# EAGLE design UnoSensor (EAGLE 9.3.0)
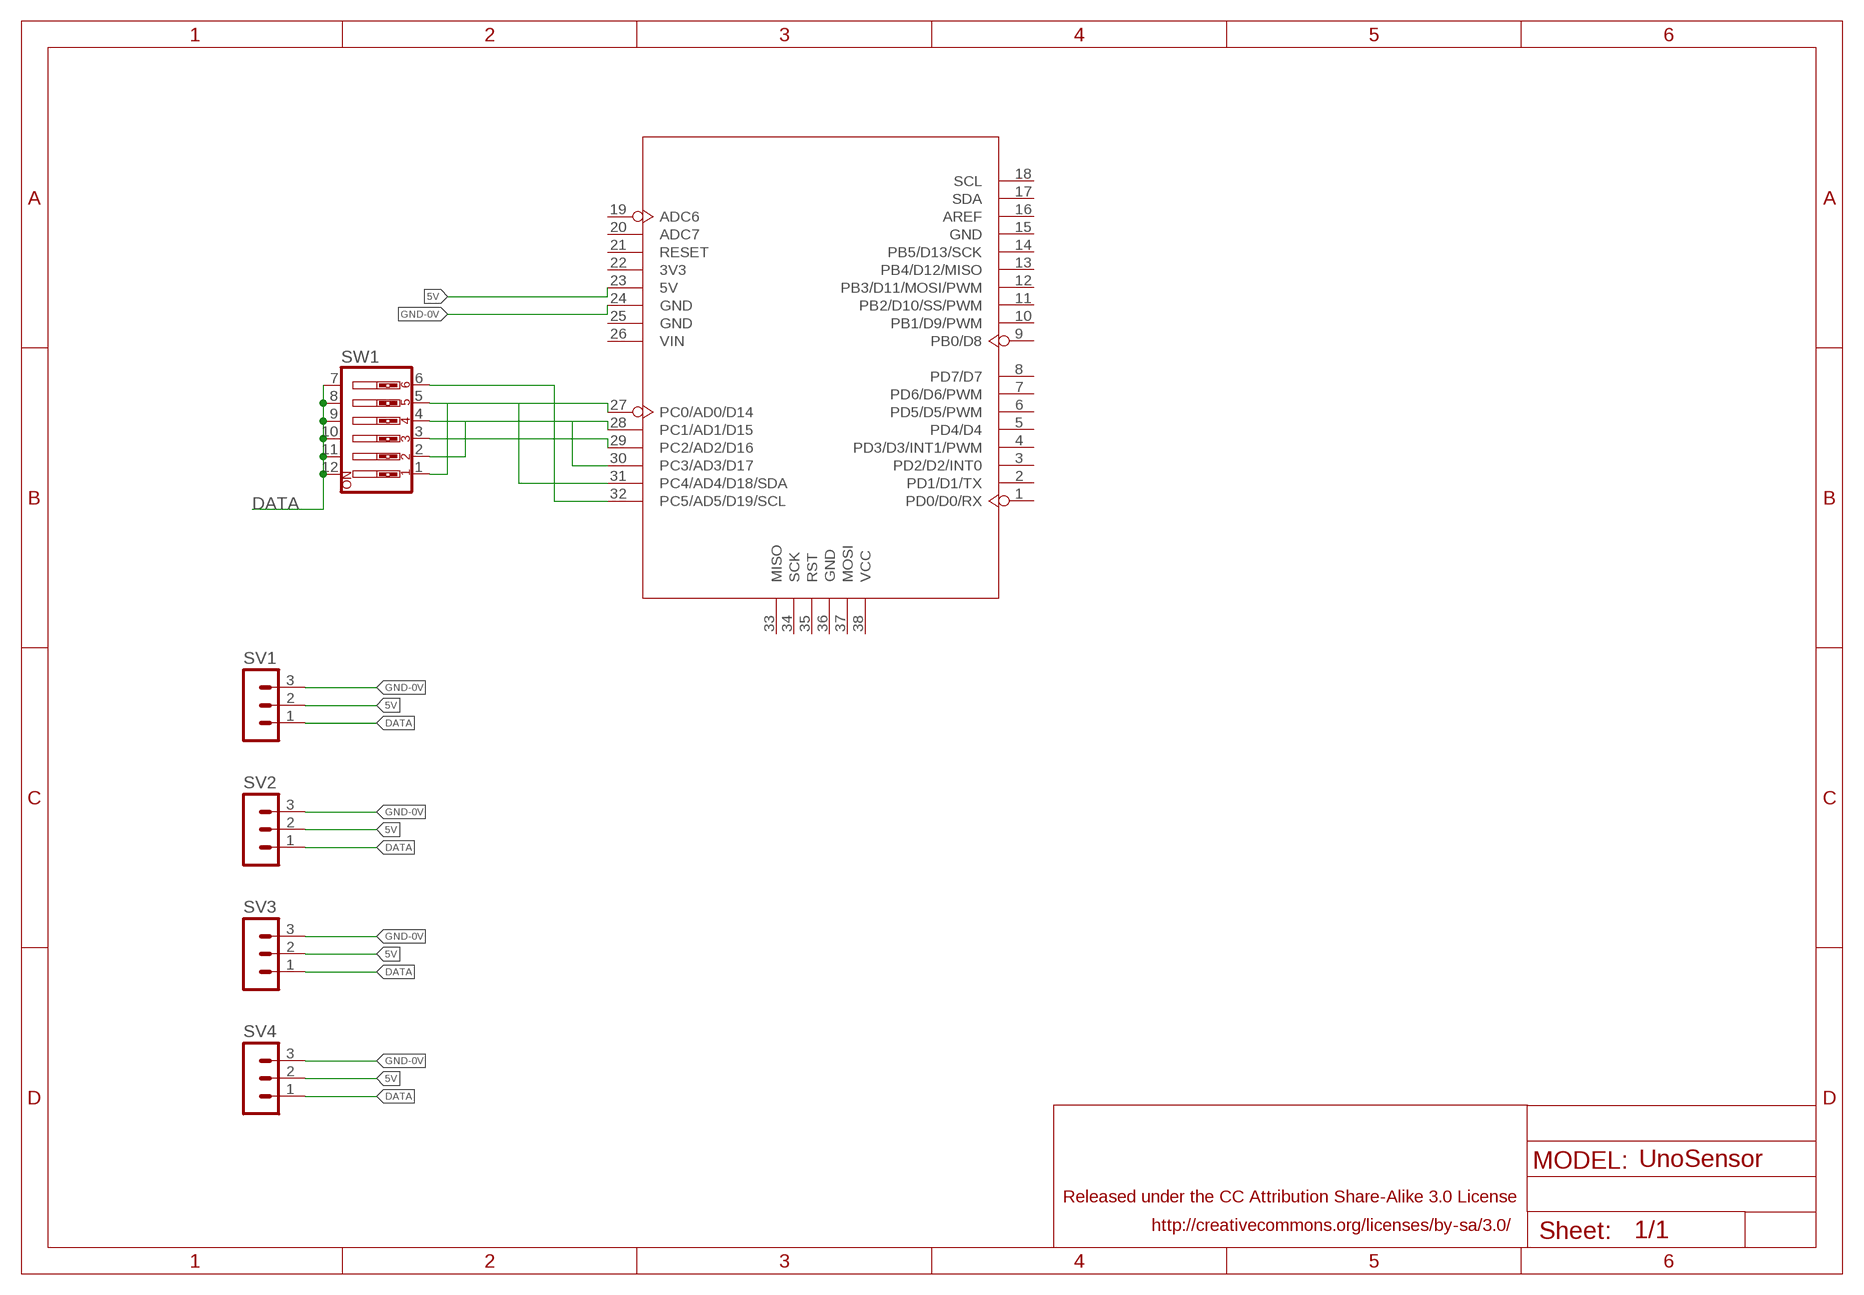
[diagram p0: schematic, sheet 1]

## Parts
SV1  2  MA03-1  [MA03-1]
SV2  MA03-1  [MA03-1]
SV3  MA03-1  [MA03-1]
SV4  MA03-1  [MA03-1]
SW1  SW_DIP-6  [EDG-06]
U5  MOUDLE_ARDUINO-38P328P_NO_VIA  [MOUDLE_ARDUINO-328P--]

## Nets
5V: SV1.2 SV2.2 SV3.2 SV4.2 U5.23(5V)
DATA: SV1.1 SV2.1 SV3.1 SV4.1 SW1.7 SW1.8 SW1.9 SW1.10 SW1.11 SW1.12
GND-0V: SV1.3 SV2.3 SV3.3 SV4.3 U5.24(GND)
N$1: SW1.1 U5.27(PC0/AD0/D14)
N$3: SW1.2 U5.28(PC1/AD1/D15)
N$4: SW1.3 U5.29(PC2/AD2/D16)
N$5: SW1.4 U5.30(PC3/AD3/D17)
N$6: SW1.5 U5.31(PC4/AD4/D18/SDA)
N$7: SW1.6 U5.32(PC5/AD5/D19/SCL)
Unconnected: U5.1(PD0/D0/RX) U5.2(PD1/D1/TX) U5.3(PD2/D2/INT0) U5.4(PD3/D3/INT1/PWM) U5.5(PD4/D4) U5.6(PD5/D5/PWM) U5.7(PD6/D6/PWM) U5.8(PD7/D7) U5.9(PB0/D8) U5.10(PB1/D9/PWM) U5.11(PB2/D10/SS/PWM) U5.12(PB3/D11/MOSI/PWM) U5.13(PB4/D12/MISO) U5.14(PB5/D13/SCK) U5.15(GND) U5.16(AREF) U5.17(SDA) U5.18(SCL) U5.19(ADC6) U5.20(ADC7) U5.21(RESET) U5.22(3V3) U5.25(GND) U5.26(VIN) U5.33(MISO) U5.34(SCK) U5.35(RST) U5.36(GND) U5.37(MOSI) U5.38(VCC)

## Library data of the parts
SV1-SV4 = CON_LSTB:MA03-1: PIN HEADER
SW1 = SPECIAL:SW_DIP-6: DIP SWITCH
U5 = board_arduino:MOUDLE_ARDUINO-38P

## Net classes
0 default: clearance 0.205 mm
2 gnd: width 0.305 mm, drill 0.305 mm, clearance 0.254 mm

## Board
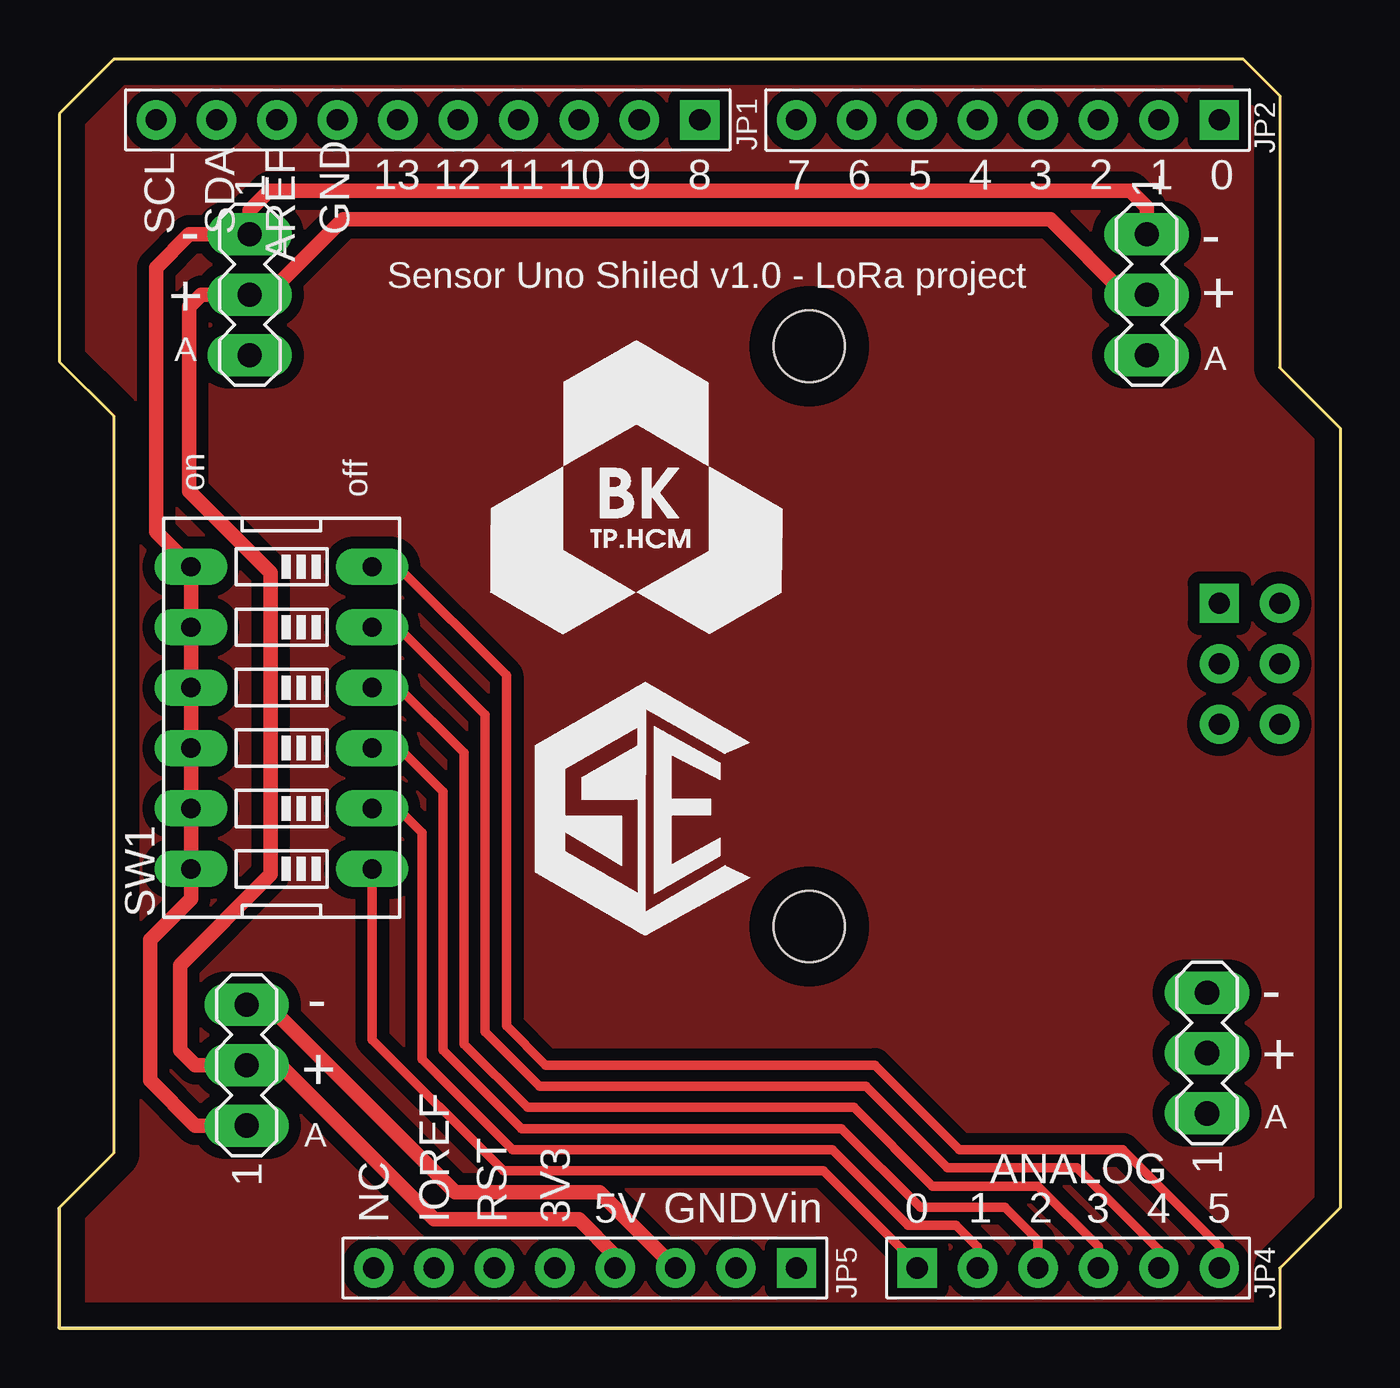
[diagram p1: board, top side]
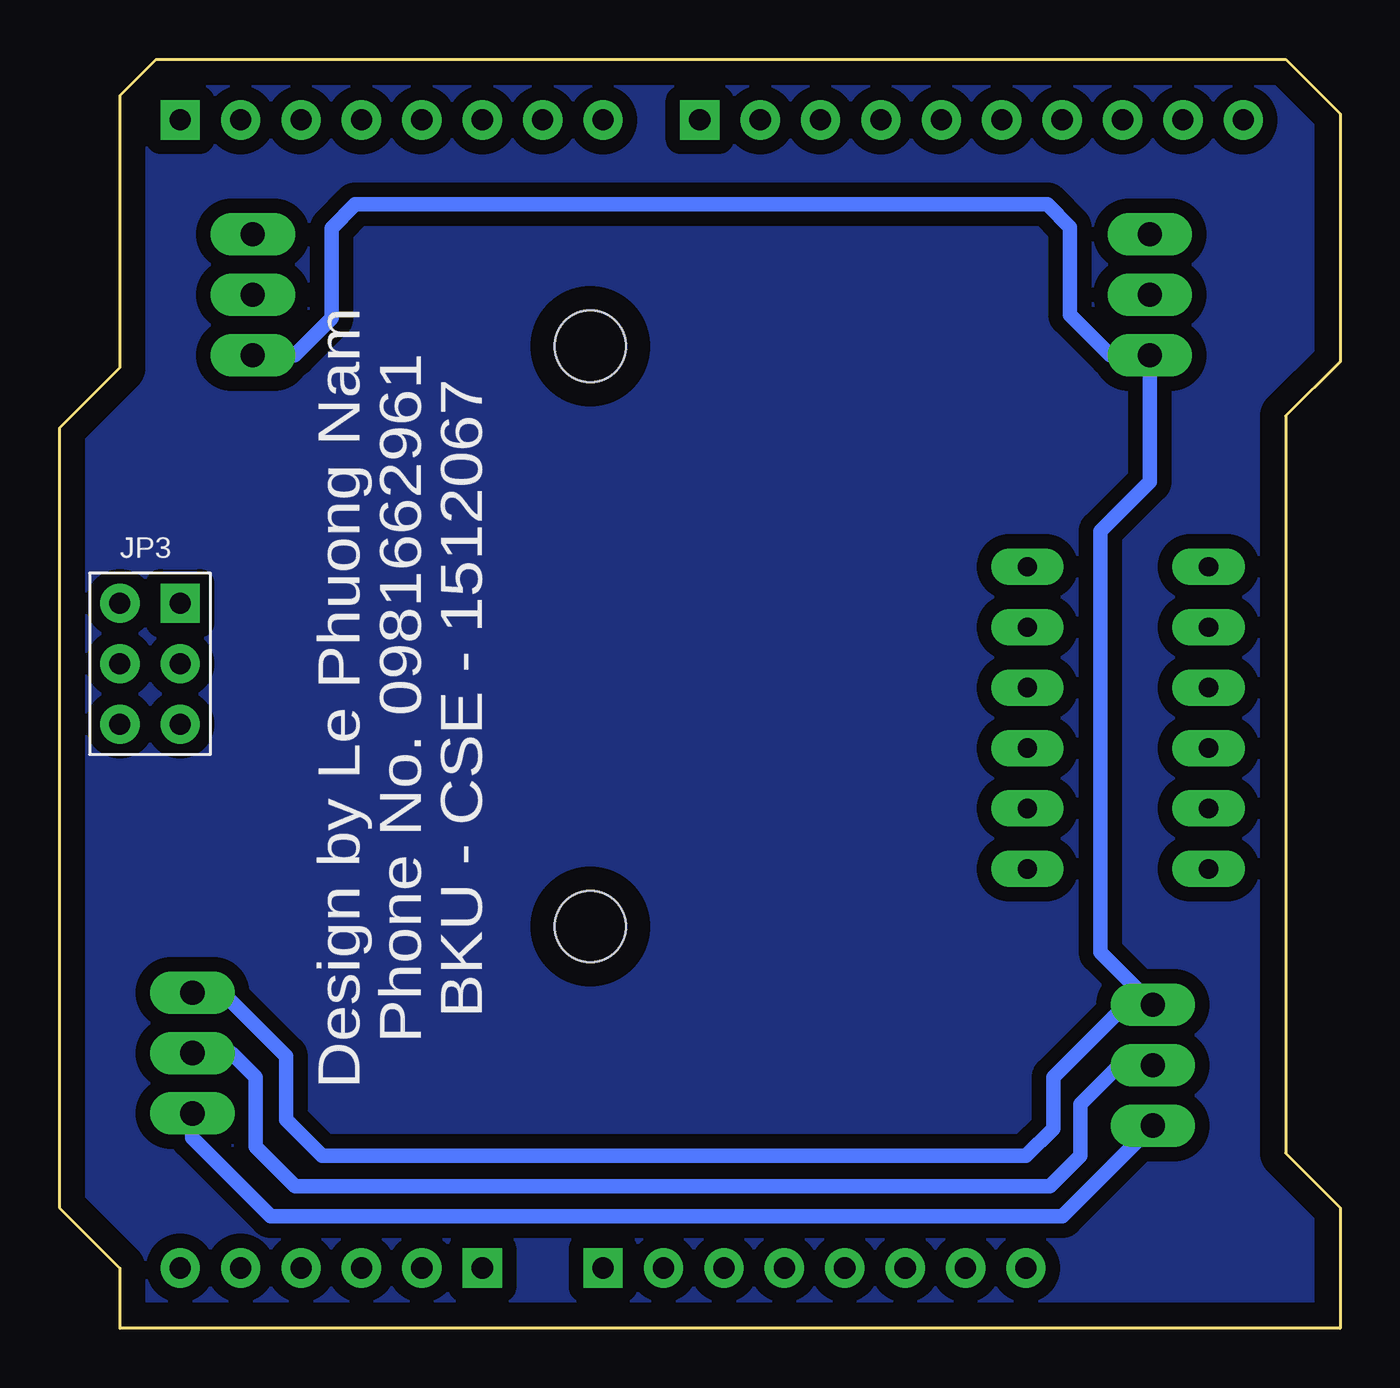
[diagram p2: board, bottom side, seen from below]

Size 53.85 x 53.34 mm. Coordinates in mm from the lower left corner, seen from the top.
Copper layers (1*16): Top 0.035mm / dielectric 1.5mm / Bottom 0.035mm
Design rules "default *": minimum track width 10mil, minimum drill 10mil, track to track 10mil, track to pad 10mil, pad to pad 10mil, via to via 10mil, smd to smd 10mil, copper to edge 40mil, drill to drill 10mil, minimum pad ring 10mil, minimum via ring 8mil, stop-mask expansion 4mil, vias tented up to drill 30mil, thermal gap 10mil
Holes 3 mm at 31.53,16.9 31.53,41.29

### Footprints (pad centres in the part's own frame; a part is rotated, then mirrored left to right if it is on the bottom)
MA03-1 = drill 1.016 pad 1.778 long: 1 -2.54,0; 2 0,0; 3 2.54,0
EDG-06 = drill 0.813 pad 1.524 long: 1 -6.35,-3.81; 2 -3.81,-3.81; 3 -1.27,-3.81; 4 1.27,-3.81; 5 3.81,-3.81; 6 6.35,-3.81; 7 6.35,3.81; 8 3.81,3.81; 9 1.27,3.81; 10 -1.27,3.81; 11 -3.81,3.81; 12 -6.35,3.81
MOUDLE_ARDUINO-328P-- = drill 0.889 pad 1.651 square: 1 27.94,24.13; 9 6.096,24.13; 26 10.16,-24.13; 27 15.24,-24.13; 33 27.94,3.81 | drill 0.889 pad 1.651: 2 25.4,24.13; 3 22.86,24.13; 4 20.32,24.13; 5 17.78,24.13; 6 15.24,24.13; 7 12.7,24.13; 8 10.16,24.13; 10 3.556,24.13; 11 1.016,24.13; 12 -1.524,24.13; 13 -4.064,24.13; 14 -6.604,24.13; 15 -9.144,24.13; 16 -11.684,24.13; 17 -14.224,24.13; 18 -16.764,24.13; 19 -7.62,-24.13; 20 -5.08,-24.13; 21 -2.54,-24.13; 22 0,-24.13; 23 2.54,-24.13; 24 5.08,-24.13; 25 7.62,-24.13; 28 17.78,-24.13; 29 20.32,-24.13; 30 22.86,-24.13; 31 25.4,-24.13; 32 27.94,-24.13; 34 27.94,1.27; 35 27.94,-1.27; 36 30.48,-1.27; 37 30.48,1.27; 38 30.48,3.81

### Placement (x,y rotation side)
SV1  7.87,11.07 90 top
SV2  8,43.45 270 top
SV3  45.72,43.45 270 top
SV4  48.26,11.58 90 top
SW1  9.34,25.67 90 top
U5  20.83,26.67 0 top

### Tracks (layer width: path | path; a pad name or v marks a point on that pad's centre or on a via)
5V
  Top 0.61: SV3.2 44.83,43.45 41.67,46.61 11.92,46.61 8.76,43.45 SV2.2 5.97,43.45 5.46,42.94 5.46,35.2 8.89,31.77 8.89,19.08 5.08,15.27 5.08,11.7 5.71,11.07 SV1.2 9.27,11.07 15.75,4.59 21.84,4.59 23.37,3.07 U5.23
  Bottom 0.61: SV1.2 9.27,11.07 10.92,9.42 10.92,7.26 12.19,5.99 43.94,5.99 45.59,7.64 45.59,10.56 46.61,11.58 SV4.2
BOTTOM_SOLID
  pour Bottom (isolate 0.61): 0,0.02 51.31,0.02 51.31,2.56 53.85,5.1 53.85,37.86 51.31,40.4 51.31,51.83 49.78,53.36 2.28,53.36 0,51.07 0,40.66 2.28,38.37 2.28,7.38 0,5.1
DATA
  Top 0.61: SV1.1 5.71,8.53 3.81,10.43 3.81,16.34 5.53,18.06 SW1.12 SW1.11 SW1.10 SW1.9 SW1.8 SW1.7 4.06,33.48 4.06,44.6 5.46,45.99 SV2.1 8,47.01 8.81,47.82 45.03,47.82 45.72,47.14 SV3.1
  Bottom 0.61: SV1.1 11.68,4.72 44.96,4.72 48.26,8.02 SV4.1
GND-0V
  Top 0.61: SV1.3 8.76,13.61 16.64,5.73 22.72,5.73 U5.24
  Bottom 0.61: SV3.3 43.96,40.91 42.41,42.46 42.41,46.25 41.41,47.25 12.31,47.25 11.36,46.29 11.36,42.62 9.65,40.91 SV2.3 8,35.59 10.08,33.51 10.08,15.82 SV1.3 9.02,13.61 12.06,10.56 12.06,8.4 13.21,7.26 42.8,7.26 44.32,8.78 44.32,11.45 47.12,14.24 47.5,14.24 47.62,14.12 SV4.3
N$1
  Top 0.406: U5.27 36.07,2.68 32.13,6.62 18.67,6.62 13.15,12.14 SW1.1
N$3
  Top 0.406: U5.28 38.61,3.43 37.7,4.34 35.69,4.34 32.51,7.51 19.05,7.51 15.24,11.32 15.24,20.85 14.26,21.83 13.18,21.83 SW1.2
N$4
  Top 0.406: U5.29 41.15,3.7 39.75,5.1 36.19,5.1 32.89,8.4 19.43,8.4 16.13,11.7 16.13,22.57 14.3,24.4 SW1.3
N$5
  Top 0.406: U5.30 43.69,3.45 41.15,5.99 36.7,5.99 33.4,9.29 19.68,9.29 17.02,11.96 17.02,24.19 14.27,26.94 SW1.4
N$6
  Top 0.406: U5.31 46.23,3.3 42.78,6.75 37.34,6.75 33.91,10.18 20.19,10.18 17.91,12.46 17.91,25.79 14.21,29.48 SW1.5
N$7
  Top 0.406: SW1.6 | U5.32 48.77,3.47 44.72,7.51 37.85,7.51 34.29,11.07 20.45,11.07 18.8,12.72 18.8,27.45 14.23,32.02 SW1.6 | SW1.6
TOP_SOLID
  pour Top (isolate 0.508): 51.31,0.02 51.31,2.56 53.85,5.1 53.85,37.86 51.31,40.4 51.31,51.83 49.78,53.36 2.28,53.36 0,51.07 0,40.66 2.28,38.37 2.28,7.38 0,5.1 0,0.02

### Text on the board
tNames: - | - | Sensor Uno Shiled v1.0 - LoRa project | + | + | A | A | on | off | - | - | + | + | A | A
bNames: Design by Le Phuong Nam / Phone No. 0981662961 / BKU - CSE - 1512067